# Altium schematic sheet HeaderB.SchDoc: HPBI Controller
size B; ApprovedBy: J Johnson; CheckedBy: J Johnson; Author: sdfasdfdfAEFfasdFfaF; DrawnBy: J Johnson; Organization: Opsero Electronic Design; Address1: 21-915 Av. Marguerite-Bourgeoys; Address2: Québec (QC); Address3: G1S 3X4; DocumentNumber: OP009-001-SCH; Revision: 1.0; SheetNumber: 10; SheetTotal: 16; Tel1: (581) 308-8830; Tel2: (581) 308-8830; Project: HPBI Controller; CheckedDate: yyyy-mm-dd; Sheet: Header B; PageSetup: Record=PageOptions|CenterHorizontal=True|CenterVertical=True|PrintScale=1.08|XCorrection=1.00|YCorrection=1.00|PrintKind=0|BorderSize=5000000|LeftOffset=0|BottomOffset=0|Orientation=2|PaperLength=1000|PaperWidth=1000|Scale=100|PaperSource=7|PrintQuality=-4|MediaType=1|DitherType=10|PaperKind=Tabloid     [11 x 17 in]|PrintScaleMode=1; DrawDate: 2013-12-13; SchTitle: HPBI Controller; RevDescription: Preliminary; RevDate: 2014-01-29; RevBy: J Johnson
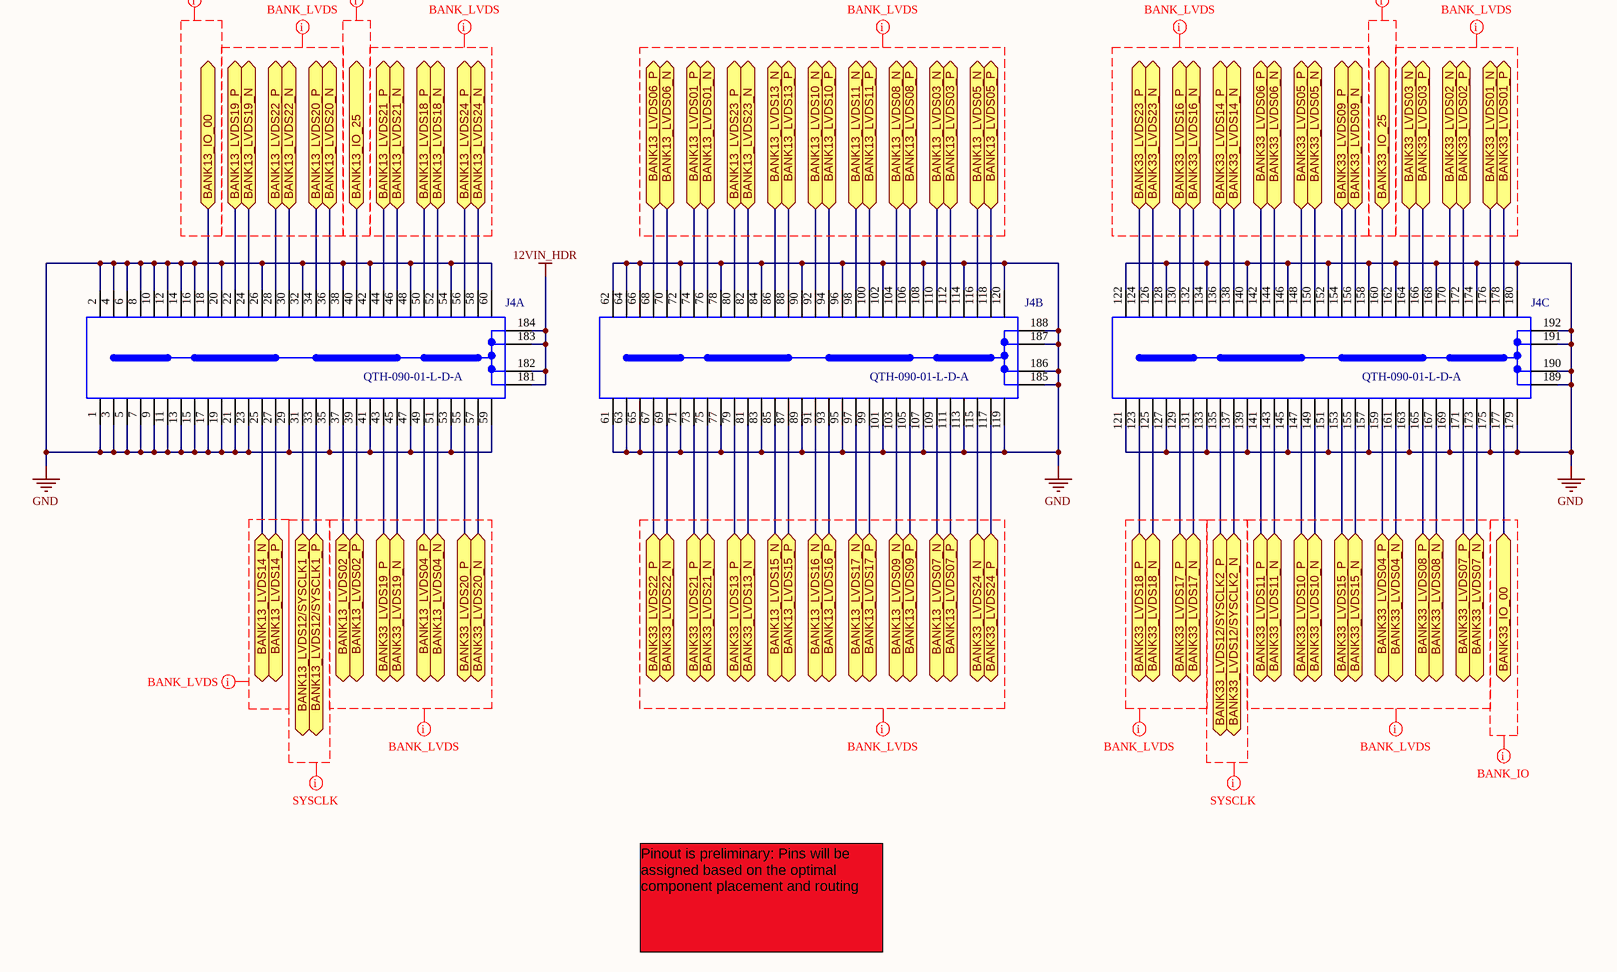
[diagram p0: HeaderB.SchDoc]

## Parts
J4  QTH-090-01-L-D-A  [QTH-090-01-L-D-A]  (parts A,B,C of 3)

## Ports
BANK13_IO_00 (bidir), BANK13_IO_25 (bidir), BANK13_LVDS01_N (bidir), BANK13_LVDS01_P (bidir), BANK13_LVDS02_N (bidir), BANK13_LVDS02_P (bidir), BANK13_LVDS03_N (bidir), BANK13_LVDS03_P (bidir), BANK13_LVDS04_N (bidir), BANK13_LVDS04_P (bidir), BANK13_LVDS05_N (bidir), BANK13_LVDS05_P (bidir), BANK13_LVDS06_N (bidir), BANK13_LVDS06_P (bidir), BANK13_LVDS07_N (bidir), BANK13_LVDS07_P (bidir), BANK13_LVDS08_N (bidir), BANK13_LVDS08_P (bidir), BANK13_LVDS09_N (bidir), BANK13_LVDS09_P (bidir), BANK13_LVDS10_N (bidir), BANK13_LVDS10_P (bidir), BANK13_LVDS11_N (bidir), BANK13_LVDS11_P (bidir), BANK13_LVDS12/SYSCLK1_N (bidir), BANK13_LVDS12/SYSCLK1_P (bidir), BANK13_LVDS13_N (bidir), BANK13_LVDS13_P (bidir), BANK13_LVDS14_N (bidir), BANK13_LVDS14_P (bidir), BANK13_LVDS15_N (bidir), BANK13_LVDS15_P (bidir), BANK13_LVDS16_N (bidir), BANK13_LVDS16_P (bidir), BANK13_LVDS17_N (bidir), BANK13_LVDS17_P (bidir), BANK13_LVDS18_N (bidir), BANK13_LVDS18_P (bidir), BANK13_LVDS19_N (bidir), BANK13_LVDS19_P (bidir), BANK13_LVDS20_N (bidir), BANK13_LVDS20_P (bidir), BANK13_LVDS21_N (bidir), BANK13_LVDS21_P (bidir), BANK13_LVDS22_N (bidir), BANK13_LVDS22_P (bidir), BANK13_LVDS23_N (bidir), BANK13_LVDS23_P (bidir), BANK13_LVDS24_N (bidir), BANK13_LVDS24_P (bidir), BANK33_IO_00 (bidir), BANK33_IO_25 (bidir), BANK33_LVDS01_N (bidir), BANK33_LVDS01_P (bidir), BANK33_LVDS02_N (bidir), BANK33_LVDS02_P (bidir), BANK33_LVDS03_N (bidir), BANK33_LVDS03_P (bidir), BANK33_LVDS04_N (bidir), BANK33_LVDS04_P (bidir), BANK33_LVDS05_N (bidir), BANK33_LVDS05_P (bidir), BANK33_LVDS06_N (bidir), BANK33_LVDS06_P (bidir), BANK33_LVDS07_N (bidir), BANK33_LVDS07_P (bidir), BANK33_LVDS08_N (bidir), BANK33_LVDS08_P (bidir), BANK33_LVDS09_N (bidir), BANK33_LVDS09_P (bidir), BANK33_LVDS10_N (bidir), BANK33_LVDS10_P (bidir), BANK33_LVDS11_N (bidir), BANK33_LVDS11_P (bidir), BANK33_LVDS12/SYSCLK2_N (bidir), BANK33_LVDS12/SYSCLK2_P (bidir), BANK33_LVDS13_N (bidir), BANK33_LVDS13_P (bidir), BANK33_LVDS14_N (bidir), BANK33_LVDS14_P (bidir), BANK33_LVDS15_N (bidir), BANK33_LVDS15_P (bidir), BANK33_LVDS16_N (bidir), BANK33_LVDS16_P (bidir), BANK33_LVDS17_N (bidir), BANK33_LVDS17_P (bidir), BANK33_LVDS18_N (bidir), BANK33_LVDS18_P (bidir), BANK33_LVDS19_N (bidir), BANK33_LVDS19_P (bidir), BANK33_LVDS20_N (bidir), BANK33_LVDS20_P (bidir), BANK33_LVDS21_N (bidir), BANK33_LVDS21_P (bidir), BANK33_LVDS22_N (bidir), BANK33_LVDS22_P (bidir), BANK33_LVDS23_N (bidir), BANK33_LVDS23_P (bidir), BANK33_LVDS24_N (bidir), BANK33_LVDS24_P (bidir)

## Nets
12VIN_HDR: J4.181 J4.182 J4.183 J4.184
GND: J4.1 J4.2 J4.3 J4.4 J4.5 J4.6 J4.7 J4.8 J4.9 J4.10 J4.11 J4.12 J4.13 J4.14 J4.15 J4.16 J4.17 J4.19 J4.20 J4.21 J4.23 J4.26 J4.29 J4.32 J4.35 J4.38 J4.41 J4.42 J4.47 J4.48 J4.53 J4.54 J4.59 J4.60 J4.61 J4.62 J4.63 J4.64 J4.65 J4.66 J4.71 J4.72 J4.77 J4.78 J4.83 J4.84 J4.89 J4.90 J4.95 J4.96 J4.101 J4.102 J4.107 J4.108 J4.113 J4.114 J4.119 J4.120 J4.121 J4.122 J4.127 J4.128 J4.133 J4.134 J4.139 J4.140 J4.145 J4.146 J4.151 J4.152 J4.157 J4.158 J4.162 J4.163 J4.168 J4.169 J4.174 J4.175 J4.179 J4.180 J4.185 J4.186 J4.187 J4.188 J4.189 J4.190 J4.191 J4.192
BANK13_IO_00: J4.18 ; port BANK13_IO_00
BANK13_IO_25: J4.40 ; port BANK13_IO_25
BANK13_LVDS01_N: J4.76 ; port BANK13_LVDS01_N
BANK13_LVDS01_P: J4.74 ; port BANK13_LVDS01_P
BANK13_LVDS02_N: J4.37 ; port BANK13_LVDS02_N
BANK13_LVDS02_P: J4.39 ; port BANK13_LVDS02_P
BANK13_LVDS03_N: J4.110 ; port BANK13_LVDS03_N
BANK13_LVDS03_P: J4.112 ; port BANK13_LVDS03_P
BANK13_LVDS04_N: J4.51 ; port BANK13_LVDS04_N
BANK13_LVDS04_P: J4.49 ; port BANK13_LVDS04_P
BANK13_LVDS05_N: J4.116 ; port BANK13_LVDS05_N
BANK13_LVDS05_P: J4.118 ; port BANK13_LVDS05_P
BANK13_LVDS06_N: J4.70 ; port BANK13_LVDS06_N
BANK13_LVDS06_P: J4.68 ; port BANK13_LVDS06_P
BANK13_LVDS07_N: J4.109 ; port BANK13_LVDS07_N
BANK13_LVDS07_P: J4.111 ; port BANK13_LVDS07_P
BANK13_LVDS08_N: J4.104 ; port BANK13_LVDS08_N
BANK13_LVDS08_P: J4.106 ; port BANK13_LVDS08_P
BANK13_LVDS09_N: J4.103 ; port BANK13_LVDS09_N
BANK13_LVDS09_P: J4.105 ; port BANK13_LVDS09_P
BANK13_LVDS10_N: J4.92 ; port BANK13_LVDS10_N
BANK13_LVDS10_P: J4.94 ; port BANK13_LVDS10_P
BANK13_LVDS11_N: J4.98 ; port BANK13_LVDS11_N
BANK13_LVDS11_P: J4.100 ; port BANK13_LVDS11_P
BANK13_LVDS12/SYSCLK1_N: J4.31 ; port BANK13_LVDS12/SYSCLK1_N
BANK13_LVDS12/SYSCLK1_P: J4.33 ; port BANK13_LVDS12/SYSCLK1_P
BANK13_LVDS13_N: J4.86 ; port BANK13_LVDS13_N
BANK13_LVDS13_P: J4.88 ; port BANK13_LVDS13_P
BANK13_LVDS14_N: J4.25 ; port BANK13_LVDS14_N
BANK13_LVDS14_P: J4.27 ; port BANK13_LVDS14_P
BANK13_LVDS15_N: J4.85 ; port BANK13_LVDS15_N
BANK13_LVDS15_P: J4.87 ; port BANK13_LVDS15_P
BANK13_LVDS16_N: J4.91 ; port BANK13_LVDS16_N
BANK13_LVDS16_P: J4.93 ; port BANK13_LVDS16_P
BANK13_LVDS17_N: J4.97 ; port BANK13_LVDS17_N
BANK13_LVDS17_P: J4.99 ; port BANK13_LVDS17_P
BANK13_LVDS18_N: J4.52 ; port BANK13_LVDS18_N
BANK13_LVDS18_P: J4.50 ; port BANK13_LVDS18_P
BANK13_LVDS19_N: J4.24 ; port BANK13_LVDS19_N
BANK13_LVDS19_P: J4.22 ; port BANK13_LVDS19_P
BANK13_LVDS20_N: J4.36 ; port BANK13_LVDS20_N
BANK13_LVDS20_P: J4.34 ; port BANK13_LVDS20_P
BANK13_LVDS21_N: J4.46 ; port BANK13_LVDS21_N
BANK13_LVDS21_P: J4.44 ; port BANK13_LVDS21_P
BANK13_LVDS22_N: J4.30 ; port BANK13_LVDS22_N
BANK13_LVDS22_P: J4.28 ; port BANK13_LVDS22_P
BANK13_LVDS23_N: J4.82 ; port BANK13_LVDS23_N
BANK13_LVDS23_P: J4.80 ; port BANK13_LVDS23_P
BANK13_LVDS24_N: J4.58 ; port BANK13_LVDS24_N
BANK13_LVDS24_P: J4.56 ; port BANK13_LVDS24_P
BANK33_IO_00: J4.177 ; port BANK33_IO_00
BANK33_IO_25: J4.160 ; port BANK33_IO_25
BANK33_LVDS01_N: J4.176 ; port BANK33_LVDS01_N
BANK33_LVDS01_P: J4.178 ; port BANK33_LVDS01_P
BANK33_LVDS02_N: J4.170 ; port BANK33_LVDS02_N
BANK33_LVDS02_P: J4.172 ; port BANK33_LVDS02_P
BANK33_LVDS03_N: J4.164 ; port BANK33_LVDS03_N
BANK33_LVDS03_P: J4.166 ; port BANK33_LVDS03_P
BANK33_LVDS04_N: J4.161 ; port BANK33_LVDS04_N
BANK33_LVDS04_P: J4.159 ; port BANK33_LVDS04_P
BANK33_LVDS05_N: J4.150 ; port BANK33_LVDS05_N
BANK33_LVDS05_P: J4.148 ; port BANK33_LVDS05_P
BANK33_LVDS06_N: J4.144 ; port BANK33_LVDS06_N
BANK33_LVDS06_P: J4.142 ; port BANK33_LVDS06_P
BANK33_LVDS07_N: J4.173 ; port BANK33_LVDS07_N
BANK33_LVDS07_P: J4.171 ; port BANK33_LVDS07_P
BANK33_LVDS08_N: J4.167 ; port BANK33_LVDS08_N
BANK33_LVDS08_P: J4.165 ; port BANK33_LVDS08_P
BANK33_LVDS09_N: J4.156 ; port BANK33_LVDS09_N
BANK33_LVDS09_P: J4.154 ; port BANK33_LVDS09_P
BANK33_LVDS10_N: J4.149 ; port BANK33_LVDS10_N
BANK33_LVDS10_P: J4.147 ; port BANK33_LVDS10_P
BANK33_LVDS11_N: J4.143 ; port BANK33_LVDS11_N
BANK33_LVDS11_P: J4.141 ; port BANK33_LVDS11_P
BANK33_LVDS12/SYSCLK2_N: J4.137 ; port BANK33_LVDS12/SYSCLK2_N
BANK33_LVDS12/SYSCLK2_P: J4.135 ; port BANK33_LVDS12/SYSCLK2_P
BANK33_LVDS13_N: J4.81 ; port BANK33_LVDS13_N
BANK33_LVDS13_P: J4.79 ; port BANK33_LVDS13_P
BANK33_LVDS14_N: J4.138 ; port BANK33_LVDS14_N
BANK33_LVDS14_P: J4.136 ; port BANK33_LVDS14_P
BANK33_LVDS15_N: J4.155 ; port BANK33_LVDS15_N
BANK33_LVDS15_P: J4.153 ; port BANK33_LVDS15_P
BANK33_LVDS16_N: J4.132 ; port BANK33_LVDS16_N
BANK33_LVDS16_P: J4.130 ; port BANK33_LVDS16_P
BANK33_LVDS17_N: J4.131 ; port BANK33_LVDS17_N
BANK33_LVDS17_P: J4.129 ; port BANK33_LVDS17_P
BANK33_LVDS18_N: J4.125 ; port BANK33_LVDS18_N
BANK33_LVDS18_P: J4.123 ; port BANK33_LVDS18_P
BANK33_LVDS19_N: J4.45 ; port BANK33_LVDS19_N
BANK33_LVDS19_P: J4.43 ; port BANK33_LVDS19_P
BANK33_LVDS20_N: J4.57 ; port BANK33_LVDS20_N
BANK33_LVDS20_P: J4.55 ; port BANK33_LVDS20_P
BANK33_LVDS21_N: J4.75 ; port BANK33_LVDS21_N
BANK33_LVDS21_P: J4.73 ; port BANK33_LVDS21_P
BANK33_LVDS22_N: J4.69 ; port BANK33_LVDS22_N
BANK33_LVDS22_P: J4.67 ; port BANK33_LVDS22_P
BANK33_LVDS23_N: J4.126 ; port BANK33_LVDS23_N
BANK33_LVDS23_P: J4.124 ; port BANK33_LVDS23_P
BANK33_LVDS24_N: J4.115 ; port BANK33_LVDS24_N
BANK33_LVDS24_P: J4.117 ; port BANK33_LVDS24_P

## Layout directives
net class BANK_LVDS: (no net found under the mark)
net class BANK_LVDS_SYSCLK: (no net found under the mark)
net class BANK_IO: (no net found under the mark)

## Notes on the sheet
- Pinout is preliminary: Pins will be assigned based on the optimal component placement and routing
- REV.
- DESCRIPTION
- DATE
- APPROVED
- SHEET
- TITLE
- CONFIG.
- PROJECT
- SIZE
- SCH P/N.
- DRAWN
- B
- OF

## Library data of the parts
J4 = QTH-090-01-L-D-A: Connector Header HS .5mm 180 pin DL AU; Manufacturer 1: Samtec; PART NUMBER: QTH-090-01-L-D-A; Part Ref: QTH-090-01-L-D-A; RoHs: True; Value: QTH-090-01-L-D-A; Mfg Part Number 1: QTH-090-01-L-D-A